# EAGLE design reptolamp (EAGLE 7.2.0)
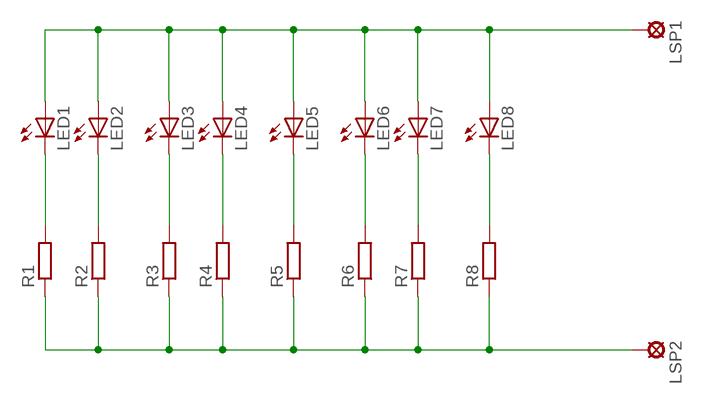
[diagram p0: schematic, sheet 1]

## Parts
LED1  LED5MM  [LED5MM]
LED2  LED5MM  [LED5MM]
LED3  LED5MM  [LED5MM]
LED4  LED5MM  [LED5MM]
LED5  LED5MM  [LED5MM]
LED6  LED5MM  [LED5MM]
LED7  LED5MM  [LED5MM]
LED8  LED5MM  [LED5MM]
LSP1  LSP10  [LSP10]
LSP2  LSP10  [LSP10]
R1  R-EU_0207/10  [0207/10]
R2  R-EU_0207/10  [0207/10]
R3  R-EU_0207/10  [0207/10]
R4  R-EU_0207/10  [0207/10]
R5  R-EU_0207/10  [0207/10]
R6  R-EU_0207/10  [0207/10]
R7  R-EU_0207/10  [0207/10]
R8  R-EU_0207/10  [0207/10]

## Nets
N$1: LSP2.MP R1.1 R2.1 R3.1 R4.1 R5.1 R6.1 R7.1 R8.1
N$2: LED1.K(C) R1.2
N$3: LED2.K(C) R2.2
N$4: LED3.K(C) R3.2
N$5: LED4.K(C) R4.2
N$6: LED5.K(C) R5.2
N$7: LED6.K(C) R6.2
N$8: LED7.K(C) R7.2
N$9: LED8.K(C) R8.2
N$10: LED1.A LED2.A LED3.A LED4.A LED5.A LED6.A LED7.A LED8.A LSP1.MP

## Library data of the parts
LED1-LED8 = led:LED: LED OSRAM: - CHIPLED LG R971, LG N971, LY N971, LG Q971, LY Q971, LO R971, LY R971 LH N974, LH R974 LS Q976, LO Q976, LY Q976 LO Q996 - Hyper CHIPLED LW Q18S LB Q993, LB Q99A, LB R99A - SideLED LS A670, LO A670, LY A670, LG A670, LP A670 LB A673, LV A673, LT A673, LW A673 LH A674 LY A675 LS A676, LA A676, LO A676, LY A676, LW A676 LS A679, LY A679, LG A679 - Hyper Micro SIDELED® LS Y876, LA Y876, LO Y876, LY Y876 LT Y87S - SmartLED LW L88C, LW L88S LB L89C, LB L89S, LG L890 LS L89K, LO L89K, LY L89K LS L896, LA L896, LO L896, LY L896 - TOPLED LS T670, LO T670, LY T670, LG T670, LP T670 LSG T670, LSP T670, LSY T670, LOP T670, LYG T670 LG T671, LOG T671, LSG T671 LB T673, LV T673, LT T673, LW T673 LH T674 LS T676, LA T676, LO T676, LY T676, LB T676, LH T676, LSB T676, LW T676 LB T67C, LV T67C, LT T67C, LS T67K, LO T67K, LY T67K, LW E67C LS E67B, LA E67B, LO E67B, LY E67B, LB E67C, LV E67C, LT E67C LW T67C LS T679, LY T679, LG T679 LS T770, LO T770, LY T770, LG T770, LP T770 LB T773, LV T773, LT T773, LW T773 LH T774 LS E675, LA E675, LY E675, LS T675 LS T776, LA T776, LO T776, LY T776, LB T776 LHGB T686 LT T68C, LB T68C - Hyper Mini TOPLED® LB M676 - Mini TOPLED Santana® LG M470 LS M47K, LO M47K, LY M47K Source: http://www.osram.convergy.de LUXEON: - LUMILED® LXK2-PW12-R00, LXK2-PW12-S00, LXK2-PW14-U00, LXK2-PW14-V00 LXK2-PM12-R00, LXK2-PM12-S00, LXK2-PM14-U00 LXK2-PE12-Q00, LXK2-PE12-R00, LXK2-PE12-S00, LXK2-PE14-T00, LXK2-PE14-U00 LXK2-PB12-K00, LXK2-PB12-L00, LXK2-PB12-M00, LXK2-PB14-N00, LXK2-PB14-P00, LXK2-PB14-Q00 LXK2-PR12-L00, LXK2-PR12-M00, LXK2-PR14-Q00, LXK2-PR14-R00 LXK2-PD12-Q00, LXK2-PD12-R00, LXK2-PD12-S00 LXK2-PH12-R00, LXK2-PH12-S00 LXK2-PL12-P00, LXK2-PL12-Q00, LXK2-PL12-R00 Source: www.luxeon.com KINGBRIGHT: KA-3528ASYC Source: www.kingbright.com
LSP1 LSP2 = solpad:LSP10: SOLDER PAD drill 1.0 mm, distributor Buerklin, 12H555
R1-R8 = rcl:R-EU_: RESISTOR, European symbol

## Board
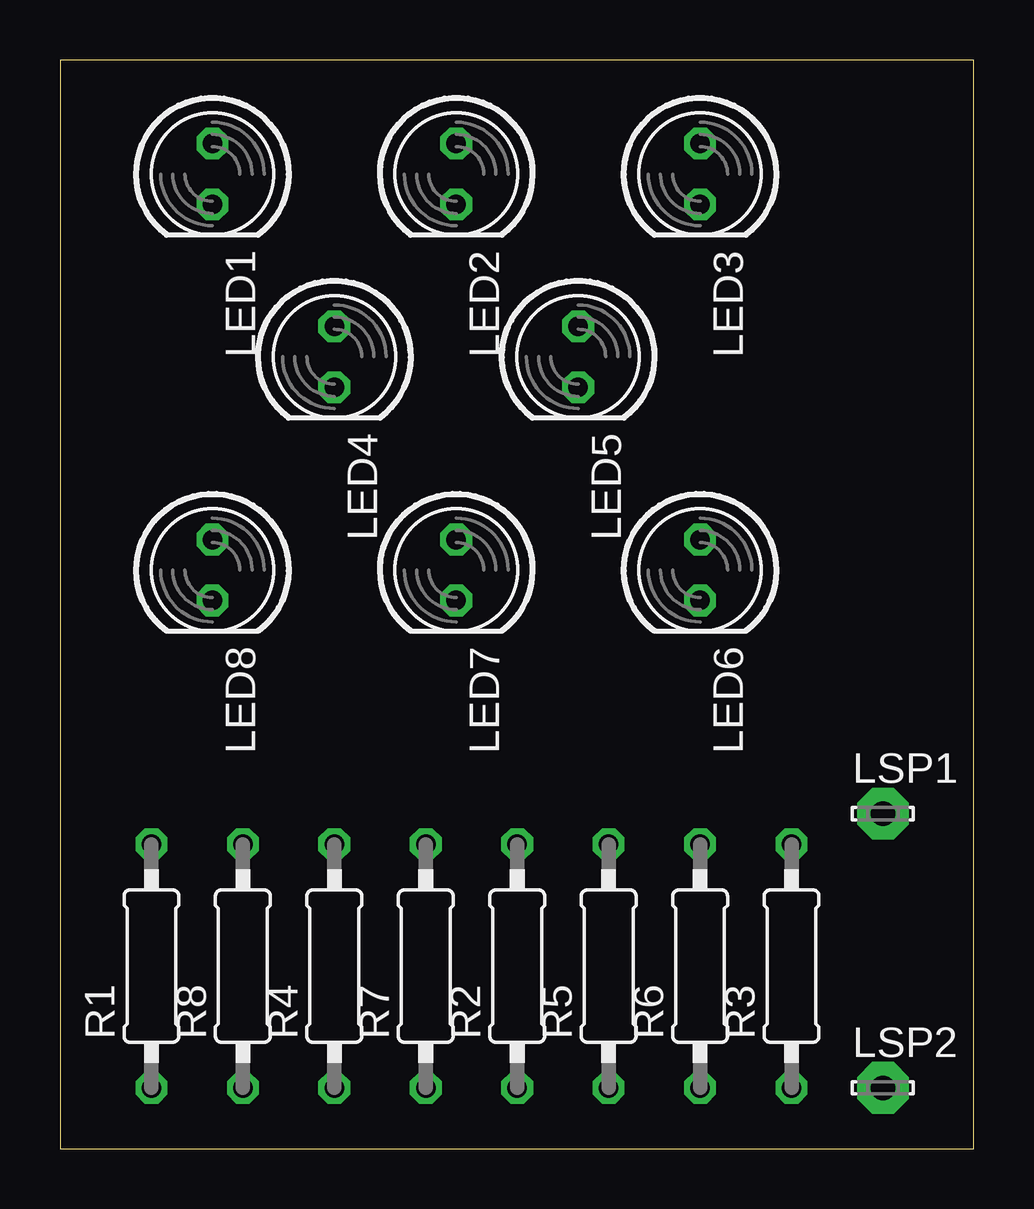
[diagram p1: board, top side]
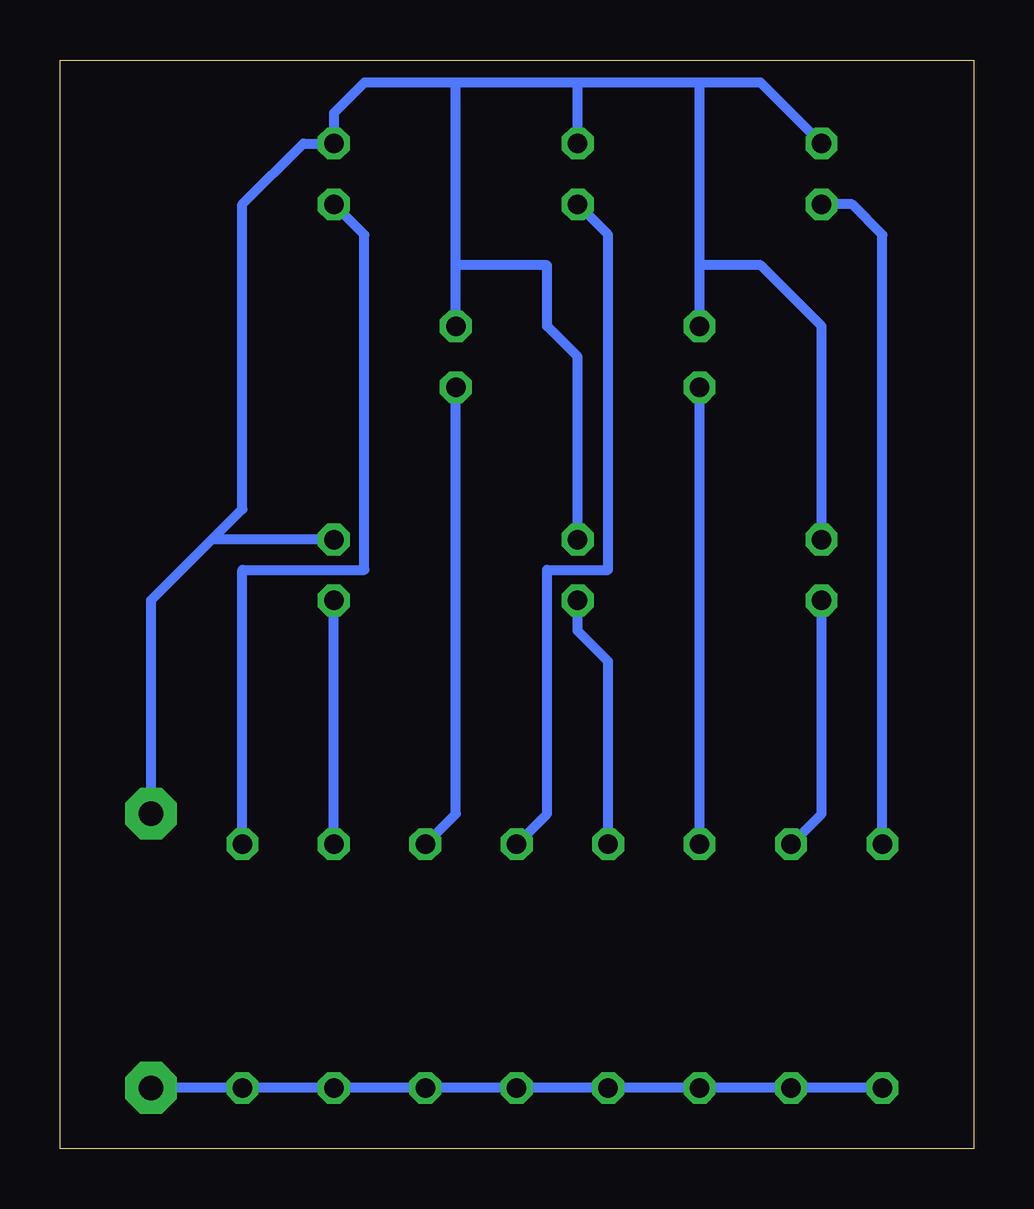
[diagram p2: board, bottom side, seen from below]

Size 38.08 x 45.39 mm. Coordinates in mm from the lower left corner, seen from the top.
Outline: 0,0 38.08,0 38.08,45.39 0,45.39 0,0
Copper layers (1*16): Top 0.035mm / dielectric 1.5mm / Bottom 0.035mm
Design rules "default": minimum track width 10mil, minimum drill 24mil, track to track 8mil, track to pad 8mil, pad to pad 8mil, via to via 8mil, smd to smd 8mil, copper to edge 40mil, drill to drill 8mil, minimum pad ring 10mil, minimum via ring 8mil, stop-mask expansion 4mil, vias tented up to drill 0mil, thermal gap 10mil

### Footprints (pad centres in the part's own frame; a part is rotated, then mirrored left to right if it is on the bottom)
LED5MM = drill 0.813 octagon: A -1.27,0; K 1.27,0
LSP10 = drill 1.016 pad 2.159 octagon: MP 0,0
0207/10 = drill 0.813 octagon: 1 -5.08,0; 2 5.08,0

### Placement (x,y rotation side)
LED1  6.35,40.64 270 top
LED2  16.51,40.64 270 top
LED3  26.67,40.64 270 top
LED4  11.43,33.02 270 top
LED5  21.59,33.02 270 top
LED6  26.67,24.13 270 top
LED7  16.51,24.13 270 top
LED8  6.35,24.13 270 top
LSP1  34.29,13.97 0 top
LSP2  34.29,2.54 0 top
R1  3.81,7.62 90 top
R2  19.05,7.62 90 top
R3  30.48,7.62 90 top
R4  11.43,7.62 90 top
R5  22.86,7.62 90 top
R6  26.67,7.62 90 top
R7  15.24,7.62 90 top
R8  7.62,7.62 90 top

### Tracks (layer width: path | path; a pad name or v marks a point on that pad's centre or on a via)
N$1
  Bottom 0.406: R1.1 R8.1 R4.1 R7.1 R2.1 R5.1 R6.1 R3.1 LSP2.MP
N$2
  Bottom 0.406: R1.2 3.81,38.1 5.08,39.37 LED1.K
N$3
  Bottom 0.406: R2.2 17.78,13.97 17.78,24.13 15.24,24.13 15.24,38.1 LED2.K
N$4
  Bottom 0.406: R3.2 30.48,24.13 25.4,24.13 25.4,38.1 LED3.K
N$5
  Bottom 0.406: R4.2 LED4.K
N$6
  Bottom 0.406: R5.2 21.59,13.97 LED5.K
N$7
  Bottom 0.406: R6.2 LED6.K
N$8
  Bottom 0.406: R7.2 15.24,20.32 16.51,21.59 LED7.K
N$9
  Bottom 0.406: R8.2 6.35,13.97 LED8.K
N$10
  Bottom 0.406: LED1.A 8.89,44.45 11.43,44.45 | 11.43,44.45 16.51,44.45 | 16.51,44.45 21.59,44.45 | 21.59,44.45 25.4,44.45 26.67,43.18 LED3.A 27.94,41.91 30.48,39.37 30.48,26.67 31.75,25.4 | LED2.A 16.51,44.45 | LED4.A 11.43,36.83 | 11.43,36.83 11.43,44.45 | LED5.A 21.59,36.83 | 21.59,36.83 21.59,44.45 | LED8.A 6.35,34.29 8.89,36.83 11.43,36.83 | 31.75,25.4 34.29,22.86 LSP1.MP | LED6.A 31.75,25.4 | LED7.A 16.51,33.02 17.78,34.29 17.78,36.83 21.59,36.83